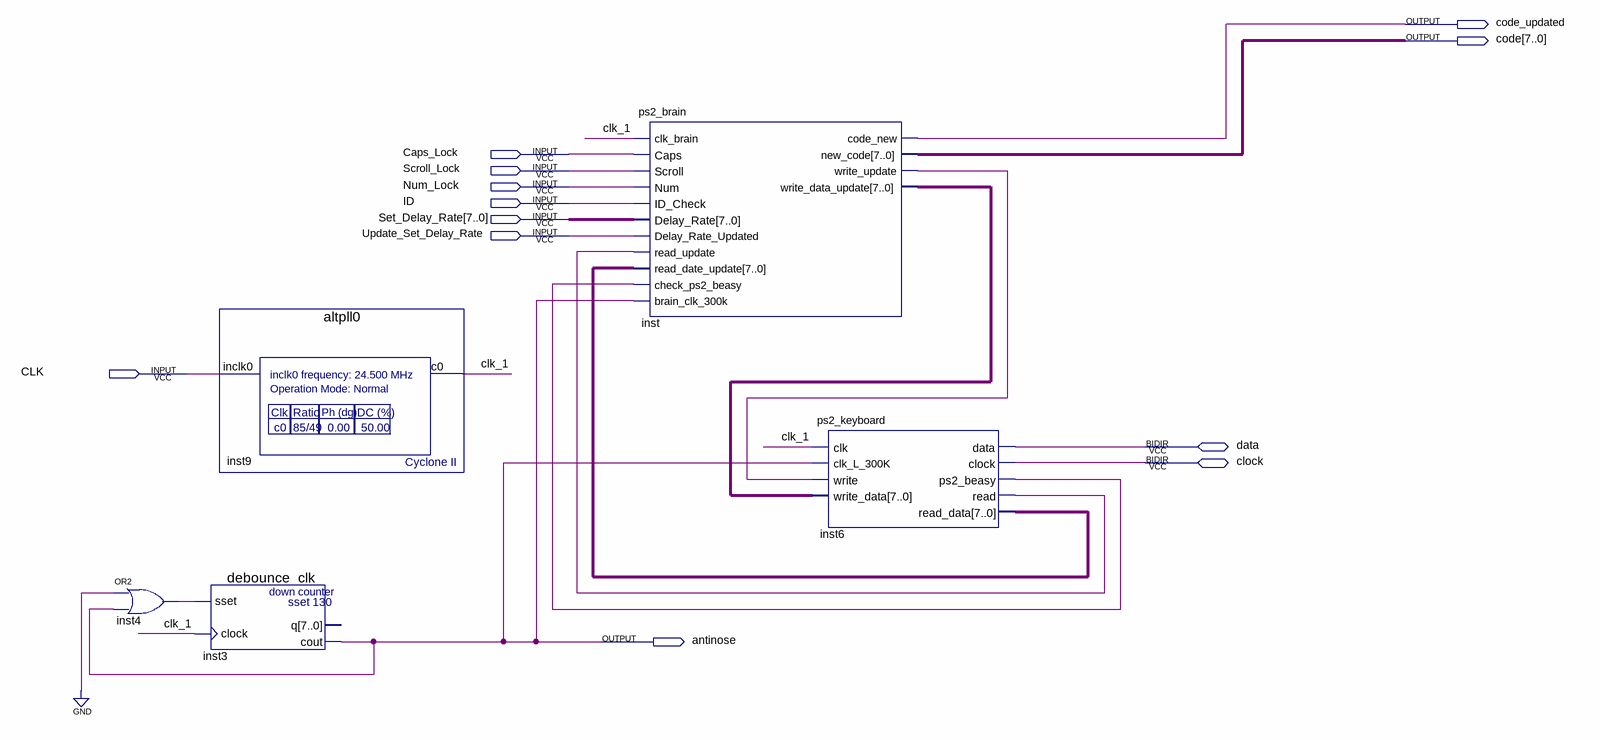
[diagram p0: schematic sheet]
// Quartus schematic keyboard.bdf as structural Verilog: 5 symbols, 12 pins
module keyboard (
  input  Caps_Lock,
  input  Scroll_Lock,
  input  Num_Lock,
  input  ID,
  input  [7:0] Set_Delay_Rate,
  input  Update_Set_Delay_Rate,
  input  CLK,
  inout  data,
  inout  clock,
  output code_updated,
  output [7:0] code,
  output antinose
);

  wire clk_1, inst4_out, inst6_ps2_beasy, inst6_read, inst_write_update;
  wire [7:0] inst6_read_data, inst_write_data_update;

  or inst4 (inst4_out, 1'b0, antinose);
  debounce_clk inst3 (.sset(inst4_out), .clock(clk_1), .cout(antinose));  // open: q
  altpll0 inst9 (.inclk0(CLK), .c0(clk_1));
  ps2_brain inst (
    .clk_brain(clk_1), .Caps(Caps_Lock), .Scroll(Scroll_Lock), .Num(Num_Lock), .ID_Check(ID),
    .Delay_Rate(Set_Delay_Rate), .Delay_Rate_Updated(Update_Set_Delay_Rate), .read_update(inst6_read),
    .read_date_update(inst6_read_data), .check_ps2_beasy(inst6_ps2_beasy), .brain_clk_300k(antinose),
    .code_new(code_updated), .new_code(code), .write_update(inst_write_update),
    .write_data_update(inst_write_data_update));
  ps2_keyboard inst6 (
    .clk(clk_1), .clk_L_300K(antinose), .write(inst_write_update), .write_data(inst_write_data_update),
    .ps2_beasy(inst6_ps2_beasy), .read(inst6_read), .read_data(inst6_read_data), .data(data), .clock(clock));
endmodule
